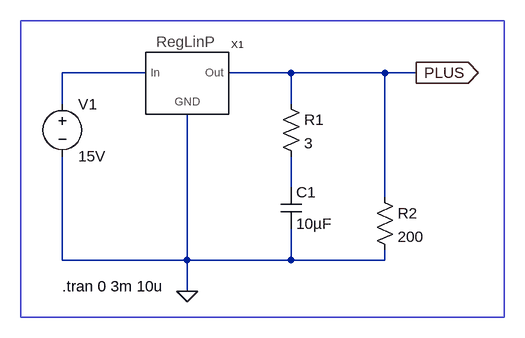
[diagram p0: schematic Switch-Mode Power Supplies - Basso- Figure 1-10b.asc]
Switch-Mode Power Supplies - Basso- Figure 1-10b.asc, the LTspice schematic file:
Version 4
SHEET 1 880 1052
WIRE -928 -144 -1056 -144
WIRE -704 -144 -800 -144
WIRE -560 -144 -704 -144
WIRE -512 -144 -560 -144
WIRE -1056 -96 -1056 -144
WIRE -704 -96 -704 -144
WIRE -704 32 -704 -16
WIRE -560 48 -560 -144
WIRE -1056 144 -1056 -16
WIRE -864 144 -864 -80
WIRE -864 144 -1056 144
WIRE -704 144 -704 96
WIRE -704 144 -864 144
WIRE -560 144 -560 128
WIRE -560 144 -704 144
WIRE -864 192 -864 144
FLAG -512 -144 PLUS
IOPIN -512 -144 Out
FLAG -864 192 0
SYMBOL voltage -1056 -112 R0
WINDOW 123 0 0 Left 0
WINDOW 39 0 0 Left 0
SYMATTR InstName V1
SYMATTR Value 15V
SYMBOL res -720 -112 R0
SYMATTR InstName R1
SYMATTR Value 3
SYMBOL cap -720 32 R0
SYMATTR InstName C1
SYMATTR Value 10µF
SYMBOL res -576 32 R0
SYMATTR InstName R2
SYMATTR Value 200
SYMBOL reglinp -864 -128 R0
SYMATTR InstName X1
TEXT -1056 184 Left 0 !.tran 0 3m 10u
RECTANGLE Normal -376 232 -1120 -224

The netlist it stands for:
* Switch-Mode Power Supplies - Basso- Figure 1-10b.asc
V1 N001 0 15V
R1 PLUS N002 3
C1 N002 0 10µF
R2 PLUS 0 200
XX1 N001 PLUS 0 reglinp  ; pins In Out GND
.tran 0 3m 10u
.backanno
.end